# Altium schematic sheet Buck.SchDoc
size A4
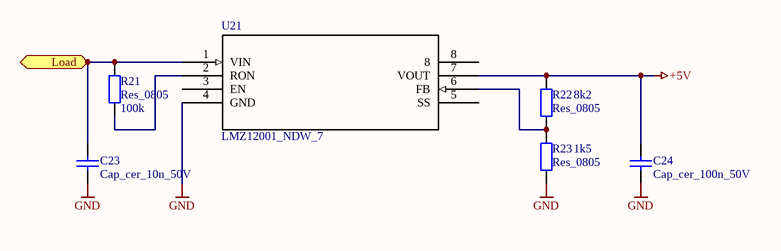
[diagram p0: Buck.SchDoc]

## Parts
C23  Cap_cer_10n_50V  [_0805]
C24  Cap_cer_100n_50V  [_0805]
R21  Res_0805  value 100k  [_0805]
R22  Res_0805  value 8k2  [_0805]
R23  Res_0805  value 1k5  [_0805]
U21  LMZ12001_NDW_7  [TZA07A]

## Ports
Load

## Nets
+5V: C24.2 R22.1 U21.7(VOUT)
GND: C23.2 C24.1 R23.2 U21.4(GND)
Load: C23.1 R21.2 U21.1(VIN) ; port Load
NetR21_1: R21.1 U21.2(RON)
NetR22_2: R22.2 R23.1 U21.6(FB)

Not connected (* = marked no-connect by the designer): U21 3(EN) 5(SS) 8

## Library data of the parts
C23 = Cap_120: QR: 0; Capacity: 10n; Voltage: 50V; UID: Cap_120; Name: Cap_cer_10n_50V; ComponentLink1URL: #NAME?; mounting: SMD
C24 = Cap_124: QR: 0; Capacity: 100n; Voltage: 50V; UID: Cap_124; Name: Cap_cer_100n_50V; ComponentLink1URL: #NAME?; mounting: SMD
R21-R23 = Res_6: UID: Res_6; Name: Res_0805; ComponentLink1URL: #NAME?; mounting: SMD
U21 = LMZ12001_NDW_7: Imported; Manufacturer: Texas Instruments; DatasheetURL: http://www.ti.com/lit/ds/symlink/lmz12001.pdf; basePN: LMZ12001; NSC_PackageReference: TZA07A; Manufacturer_Part_Number: lmz12001_ndw_7; Vendor: Texas Instruments; RefDes: RefDes; Type: DEV; Value: Value